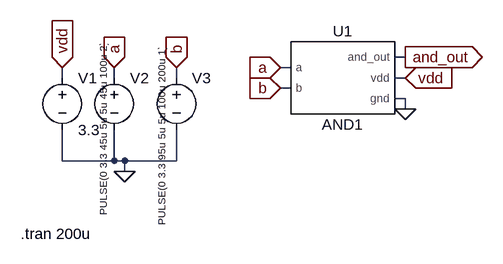
[diagram p0: schematic and1_test.asc]
and1_test.asc, the LTspice schematic file:
Version 4.1
SHEET 1 880 680
WIRE 320 112 304 112
WIRE 144 128 128 128
WIRE -208 144 -208 128
WIRE -128 144 -128 128
WIRE -32 144 -32 128
WIRE 320 144 304 144
WIRE 144 160 128 160
WIRE 320 176 304 176
WIRE 320 192 320 176
WIRE -208 272 -208 224
WIRE -128 272 -128 224
WIRE -128 272 -208 272
WIRE -112 272 -128 272
WIRE -32 272 -32 224
WIRE -32 272 -112 272
WIRE -112 288 -112 272
FLAG -112 288 0
FLAG -208 128 vdd
IOPIN -208 128 In
FLAG -128 128 a
IOPIN -128 128 In
FLAG -32 128 b
IOPIN -32 128 In
FLAG 320 192 0
FLAG 320 144 vdd
IOPIN 320 144 In
FLAG 320 112 and_out
IOPIN 320 112 Out
FLAG 128 128 a
IOPIN 128 128 In
FLAG 128 160 b
IOPIN 128 160 In
SYMBOL and1 224 144 R0
SYMATTR InstName U1
SYMBOL voltage -208 128 R0
WINDOW 123 0 0 Left 0
WINDOW 39 0 0 Left 0
SYMATTR InstName V1
SYMATTR Value 3.3
SYMBOL voltage -128 128 R0
WINDOW 3 -17 228 VLeft 1
WINDOW 123 0 0 Left 0
WINDOW 39 0 0 Left 0
SYMATTR InstName V2
SYMATTR Value PULSE(0 3.3 45u 5u 5u 45u 100u 2)
SYMBOL voltage -32 128 R0
WINDOW 3 -23 243 VLeft 1
WINDOW 123 0 0 Left 0
WINDOW 39 0 0 Left 0
SYMATTR InstName V3
SYMATTR Value PULSE(0 3.3 95u 5u 5u 100u 200u 1)
TEXT -272 384 Left 2 !.tran 200u

The netlist it stands for:
* and1_test.asc
X§U1 a b and_out vdd 0 AND1 AND1  ; pins a b and_out vdd gnd
V1 vdd 0 3.3
V2 a 0 PULSE(0 3.3 45u 5u 5u 45u 100u 2)
V3 b 0 PULSE(0 3.3 95u 5u 5u 100u 200u 1)
.tran 200u
.lib ltspice_cmdc0de.lib
.backanno
.end